# Altium project main.PrjPcb
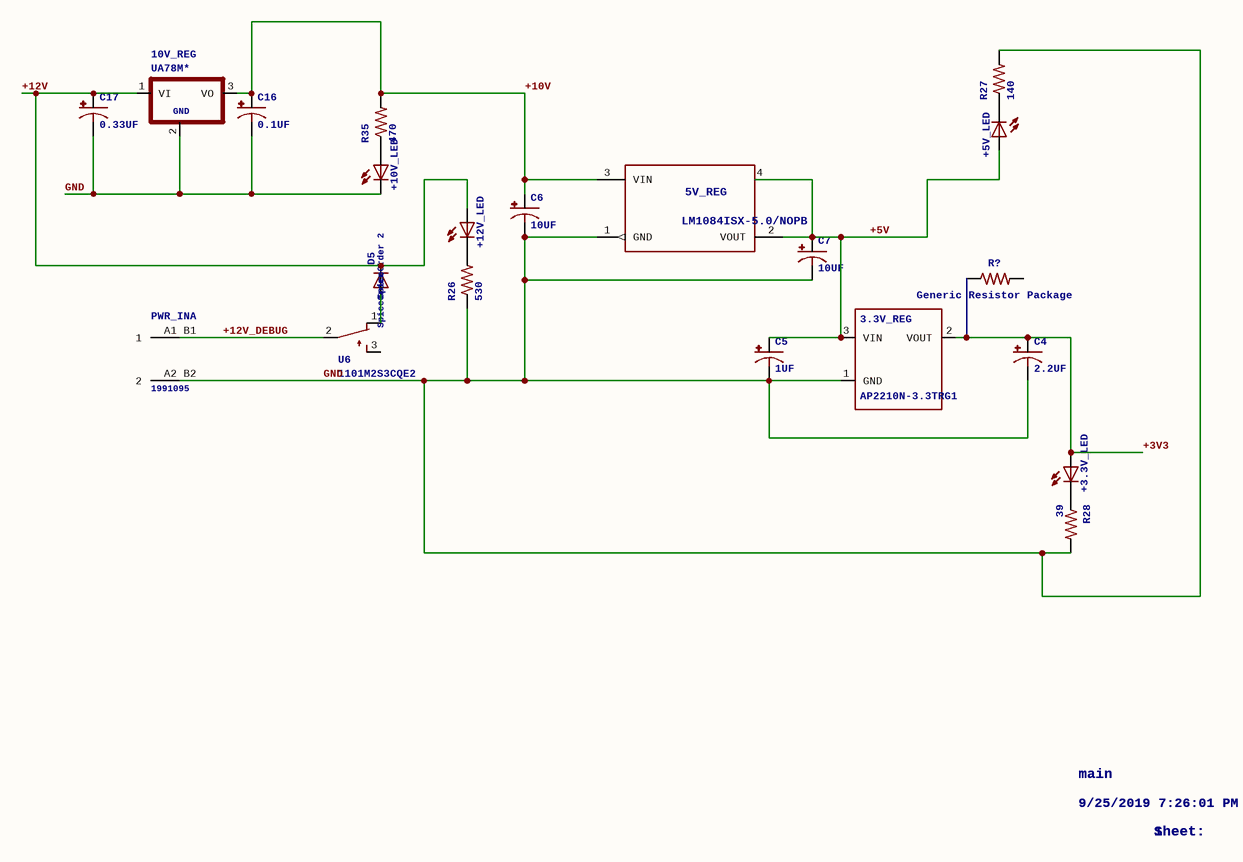
[diagram p0: main_0.SchDoc]
10 sheets, 195 parts. Net scope: global (net labels, ports and power ports of the same name join across sheets).
Board file: main.PcbDoc
Sheets:
  main_0.SchDoc
  main_1.SchDoc
  main_3.SchDoc
  main_2.SchDoc
  main_4.SchDoc
  main_5.SchDoc
  main_6.SchDoc
  main_7.SchDoc
  main_8.SchDoc
  main_9.SchDoc

## Sheet main_0.SchDoc: main
size 282 x 200 mm; Date: 9/25/2019 7:26:01 PM; SheetNumber: 1; CNAME: RJ Cunningham; GateName_1: G$1; SymbolName_1: A4L-LOC; LibraryName: frames; DeviceSetName: A4L-LOC

### Parts
(Parts that share a designator on the sheet are numbered #1, #2 ... from top to bottom, then left to right.)
3.3V_REG  AP2210N-3.3TRG1  [SOT23]
5V_REG  LM1084ISX-5.0/NOPB  [TS3B]
10V_REG  UA78M*  [TO220S]
+3.3V_LED  LED5MM  [LED5MM]  (value not drawn)
+5V_LED  LED5MM  [LED5MM]  (value not drawn)
+10V_LED  LED5MM  [LED5MM]  (value not drawn)
+12V_LED  LED5MM  [LED5MM]  (value not drawn)
C4  2.2UF  [E2,5-5]
C5  1UF  [E2,5-5]
C6  10UF  [E2,5-5]
C7  10UF  [E2,5-5]
C16  0.1UF  [E2,5-5]
C17  0.33UF  [E2,5-5]
D5  SpiceOrder1: SpiceOrder 1  SpiceOrder2: SpiceOrder 2  [DO201-15]  (hidden comment: DIODE-DO201-15)
PWR_IN  1991095  [1991095]  (value not drawn)  (parts A,B of 2)
R26  530  [R0805]
R27  140  [R0805]
R28  39  [R0805]
R35  470  [R0805]
R?#1  Generic Resistor Package  [0402]
U6  1101M2S3CQE2  [1101M2S3CQE2]

### Nets
+3V3: 3.3V_REG.2(VOUT) +3.3V_LED.A C4.+ R?#1.1
+5V: 3.3V_REG.3(VIN) 5V_REG.2(VOUT) 5V_REG.4 +5V_LED.A C5.+ C7.+
+10V: 5V_REG.3(VIN) 10V_REG.3(VO) C6.+ C16.+ R35.2
+12V: 10V_REG.1(VI) +12V_LED.A C17.+ D5.C
+12V_DEBUG: PWR_IN.A1_B1(1) U6.2(P)
GND: 3.3V_REG.1(GND) 5V_REG.1(GND) 10V_REG.2(GND) +10V_LED.K(C) C4.- C5.- C6.- C7.- C16.- C17.- PWR_IN.A2_B2(2) R26.1 R27.2 R28.2
Net+3.3V_LED_K: +3.3V_LED.K(C) R28.1
Net+5V_LED_K: +5V_LED.K(C) R27.1
Net+10V_LED_A: +10V_LED.A R35.1
Net+12V_LED_K: +12V_LED.K(C) R26.2
NetD5_A: D5.A U6.1(O)

Not connected (* = marked no-connect by the designer): R?#1 2; U6 3(S)

### Notes on the sheet
- main
- 9/25/2019 7:26:01 PM
- 1
- Sheet:
- 2
- 3
- 4
- 5
- 6
- A
- B
- C
- D

### Library data of the parts
3.3V_REG = AP2210N-3.3TRG1: 3.3V regulator300mA rating.; GateName_1: G$1; SymbolName_1: AP2210N-3.3TRG1; LibraryName: diodes-extra; DeviceSetName: AP2210N-3.3TRG1
5V_REG = LM1084ISX-5.0/NOPB: MANUFACTURER_PART_NUMBER: LM1084ISX5.0NOPB; GateName_1: A; SymbolName_1: LM1084IS-5.0; VENDOR: Texas Instruments; LibraryName: texas-extra; DeviceSetName: LM1084ISX-5.0/NOPB
10V_REG = UA78M*: POSITIVE-VOLTAGE REGULATORSSource: http://focus.ti.com/lit/ds/symlink/ua78m33.pdf; GateName_1: G$1; SymbolName_1: 78XX2GND; LibraryName: texas-extra; DeviceSetName: UA78M*; GND: GND
+3.3V_LED +5V_LED +10V_LED +12V_LED = LED5MM: LEDOSRAM:- CHIPLEDLG R971, LG N971, LY N971, LG Q971, LY Q971, LO R971, LY R971 LH N974, LH R974LS Q976, LO Q976, LY Q976LO Q996- Hyper CHIPLEDLW Q18SLB Q993, LB Q99A, LB R99A- SideLEDLS A670, LO A670, LY A670, LG A670, LP A670LB A673, LV A673, LT A673, LW A673LH A674LY A675LS A676, LA A676, LO A676, LY A676, LW A676LS A679, LY A679, LG A679-  Hyper Micro SIDELEDÂ®LS Y876, LA Y876, LO Y876, LY Y876LT Y87S- SmartLEDLW L88C, LW L88SLB L89C, LB L89S, LG L890LS L89K, LO L89K, LY L89KLS L896, LA L896, LO L896, LY L896- TOPLEDLS T670, LO T670, LY T670, LG T670, LP T670LSG T670, LSP T670, LSY T670, LOP T670, LYG T670LG T671, LOG T671, LSG T671LB T673, LV T673, LT T673, LW T673LH T674LS T676, LA T676, LO T676, LY T676, LB T676, LH T676, LSB T676, LW T676LB T67C, LV T67C, LT T67C, LS T67K, LO T67K, LY T67K, LW E67CLS E67B, LA E67B, LO E67B, LY E67B, LB E67C, LV E67C, LT E67CLW T67CLS T679, LY T679, LG T679LS T770, LO T770, LY T770, LG T770, LP T770LB T773, LV T773, LT T773, LW T773LH T774LS E675, LA E675, LY E675, LS T675LS T776, LA T776, LO T776, LY T776, LB T776LHGB T686LT T68C, LB T68C- Hyper Mini TOPLEDÂ®LB M676- Mini TOPLED SantanaÂ®LG M470LS M47K, LO M47K, LY M47K Source: http://www.osram.convergy.deLUXEON:- LUMILEDÂ®LXK2-PW12-R00, LXK2-PW12-S00, LXK2-PW14-U00, LXK2-PW14-V00LXK2-PM12-R00, LXK2-PM12-S00, LXK2-PM14-U00LXK2-PE12-Q00, LXK2-PE12-R00, LXK2-PE12-S00, LXK2-PE14-T00, LXK2-PE14-U00LXK2-PB12-K00, LXK2-PB12-L00, LXK2-PB12-M00, LXK2-PB14-N00, LXK2-PB14-P00, LXK2-PB14-Q00LXK2-PR12-L00, LXK2-PR12-M00, LXK2-PR14-Q00, LXK2-PR14-R00LXK2-PD12-Q00, LXK2-PD12-R00, LXK2-PD12-S00LXK2-PH12-R00, LXK2-PH12-S00LXK2-PL12-P00, LXK2-PL12-Q00, LXK2-PL12-R00 Source: www.luxeon.comKINGBRIGHT:KA-3528ASYCSource: www.kingbright.com; GateName_1: G$1; SymbolName_1: LED; DeviceName: 5MM; LibraryName: led; DeviceSetName: LED
C4-C7 C16 C17 = CPOL-USE2.5-5: POLARIZED CAPACITOR, American symbol; GateName_1: G$1; DeviceName: E2.5-5; SymbolName_1: CPOL-US; LibraryName: rcl; DeviceSetName: CPOL-US
D5 = DIODE-DO201-15: DIODE; GateName_1: G$1; SymbolName_1: D; DeviceSetName: DIODE-; DeviceName: DO201-15; LibraryName: diode
PWR_IN = 1991095: GateName_1: CON; SymbolName_1: STP1; GateName_2: G$2; SymbolName_2: STP2; LibraryName: con-phoenix-500-extra; DeviceSetName: 1991095
R26-R28 R35 = R-US_R0805: RESISTOR, American symbol; GateName_1: G$1; SymbolName_1: R-US; DeviceSetName: R-US_; DeviceName: R0805; LibraryName: resistor
R?#1 = RESISTOR0402: GateName_1: G$1; SymbolName_1: RESISTOR; DeviceName: 0402; LibraryName: Big Red Library; DeviceSetName: RESISTOR; Package: 0402
U6 = 1101M2S3CQE2: GateName_1: A; SymbolName_1: ON-MOM; VENDOR: C&K; LibraryName: SLIDE_SW; DeviceSetName: 1101M2S3CQE2; COPYRIGHT: Copyright (C) 2015 Accelerated Designs. All rights reserved; MANUFACTURER_PART_NUMBER: 1101M2S3CQE2

## Sheet main_1.SchDoc: main
size 282 x 200 mm; Date: 9/25/2019 7:26:04 PM; SheetNumber: 2; CNAME: RJ Cunningham; GateName_1: G$1; SymbolName_1: A4L-LOC; LibraryName: frames; DeviceSetName: A4L-LOC
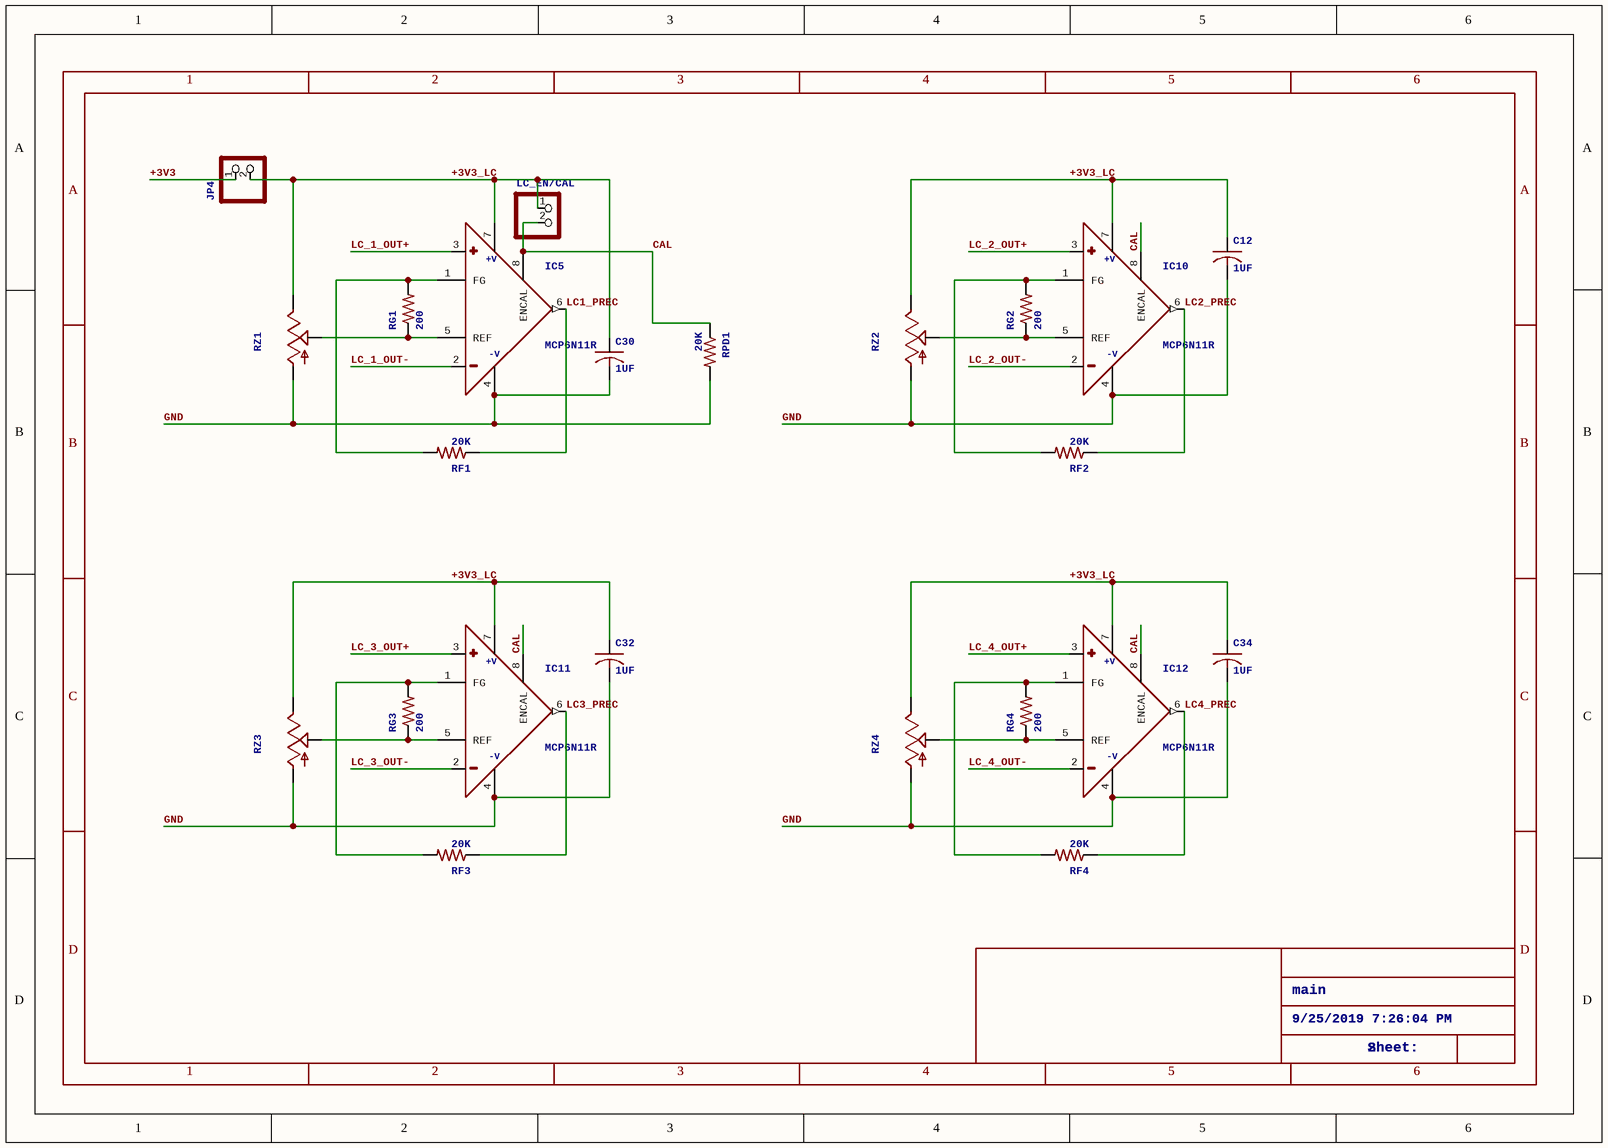
[diagram p1: main_1.SchDoc]

### Parts
C12  1UF  [C0805]
C30  1UF  [C0805]
C32  1UF  [C0805]
C34  1UF  [C0805]
IC5  MCP6N11R  [SO-8]
IC10  MCP6N11R  [SO-8]
IC11  MCP6N11R  [SO-8]
IC12  MCP6N11R  [SO-8]
JP4  PINHD-1X2  [1X02]  (value not drawn)
LC_EN/CAL  PINHD-1X2  [1X02]  (value not drawn)
RF1  20K  [R0805]
RF2  20K  [R0805]
RF3  20K  [R0805]
RF4  20K  [R0805]
RG1  200  [R0805]
RG2  200  [R0805]
RG3  200  [R0805]
RG4  200  [R0805]
RPD1  20K  [R0805]
RZ1  TRIM_US-S64W  [S64W]  (value not drawn)
RZ2  TRIM_US-S64W  [S64W]  (value not drawn)
RZ3  TRIM_US-S64W  [S64W]  (value not drawn)
RZ4  TRIM_US-S64W  [S64W]  (value not drawn)

### Nets
+3V3: JP4.1
+3V3_LC: C12.1 C30.1 C32.1 C34.1 IC5.7(+V) IC10.7(+V) IC11.7(+V) IC12.7(+V) JP4.2 LC_EN/CAL.1 RZ1.E RZ2.E RZ3.E RZ4.E
CAL: IC5.8(ENCAL) IC10.8(ENCAL) IC11.8(ENCAL) IC12.8(ENCAL) LC_EN/CAL.2 RPD1.1
GND: C12.2 C30.2 C32.2 C34.2 IC5.4(-V) IC10.4(-V) IC11.4(-V) IC12.4(-V) RPD1.2 RZ1.A RZ2.A RZ3.A RZ4.A
LC1_PREC: IC5.6(OUT) RF1.1
LC2_PREC: IC10.6(OUT) RF2.1
LC3_PREC: IC11.6(OUT) RF3.1
LC4_PREC: IC12.6(OUT) RF4.1
LC_1_OUT+: IC5.3(+)
LC_1_OUT-: IC5.2(-)
LC_2_OUT+: IC10.3(+)
LC_2_OUT-: IC10.2(-)
LC_3_OUT+: IC11.3(+)
LC_3_OUT-: IC11.2(-)
LC_4_OUT+: IC12.3(+)
LC_4_OUT-: IC12.2(-)
NetIC5_1: IC5.1(FG) RF1.2 RG1.2
NetIC5_5: IC5.5(REF) RG1.1 RZ1.S
NetIC10_1: IC10.1(FG) RF2.2 RG2.2
NetIC10_5: IC10.5(REF) RG2.1 RZ2.S
NetIC11_1: IC11.1(FG) RF3.2 RG3.2
NetIC11_5: IC11.5(REF) RG3.1 RZ3.S
NetIC12_1: IC12.1(FG) RF4.2 RG4.2
NetIC12_5: IC12.5(REF) RG4.1 RZ4.S

### Notes on the sheet
- main
- 9/25/2019 7:26:04 PM
- 2
- Sheet:
- 1
- 3
- 4
- 5
- 6
- A
- B
- C
- D

### Library data of the parts
C12 C30 C32 C34 = C-USC0805: CAPACITOR, American symbol; GateName_1: G$1; SymbolName_1: C-US; DeviceName: C0805; LibraryName: rcl; DeviceSetName: C-US; SPICEPREFIX: C
IC5 IC10-IC12 = MCP6N11R: Low Cost, Low Power, Instrumentation AmplifierSource: http://www.analog.com/UploadedFiles/Data_Sheets/37793330023930AD620_e.pdf; MPN: AD620AR; GateName_1: G$1; DeviceName: R; SymbolName_1: MCP6N11; LibraryName: microchip-extra; DeviceSetName: MCP6N11; MF: *; OC_FARNELL: 1464424; OC_NEWARK: 05F7109; +V: +V; -V: -V
JP4 LC_EN/CAL = PINHD-1X2: PIN HEADER; GateName_1: G$1; SymbolName_1: PINHD2; LibraryName: pinhead; DeviceSetName: PINHD-1X2
RF1-RF4 RG1-RG4 RPD1 = R-US_R0805: as R26 on sheet main_0; DeviceName: R0805; LibraryName: rcl
RZ1-RZ4 = TRIM_US-S64W: POTENTIOMETER; GateName_1: G$1; SymbolName_1: POT_US-; DeviceName: S64W; LibraryName: pot; DeviceSetName: TRIM_US-

## Sheet main_3.SchDoc: main
size 282 x 200 mm; Date: 9/25/2019 7:26:09 PM; SheetNumber: 4; CNAME: RJ Cunningham; GateName_1: G$1; SymbolName_1: A4L-LOC; LibraryName: frames; DeviceSetName: A4L-LOC
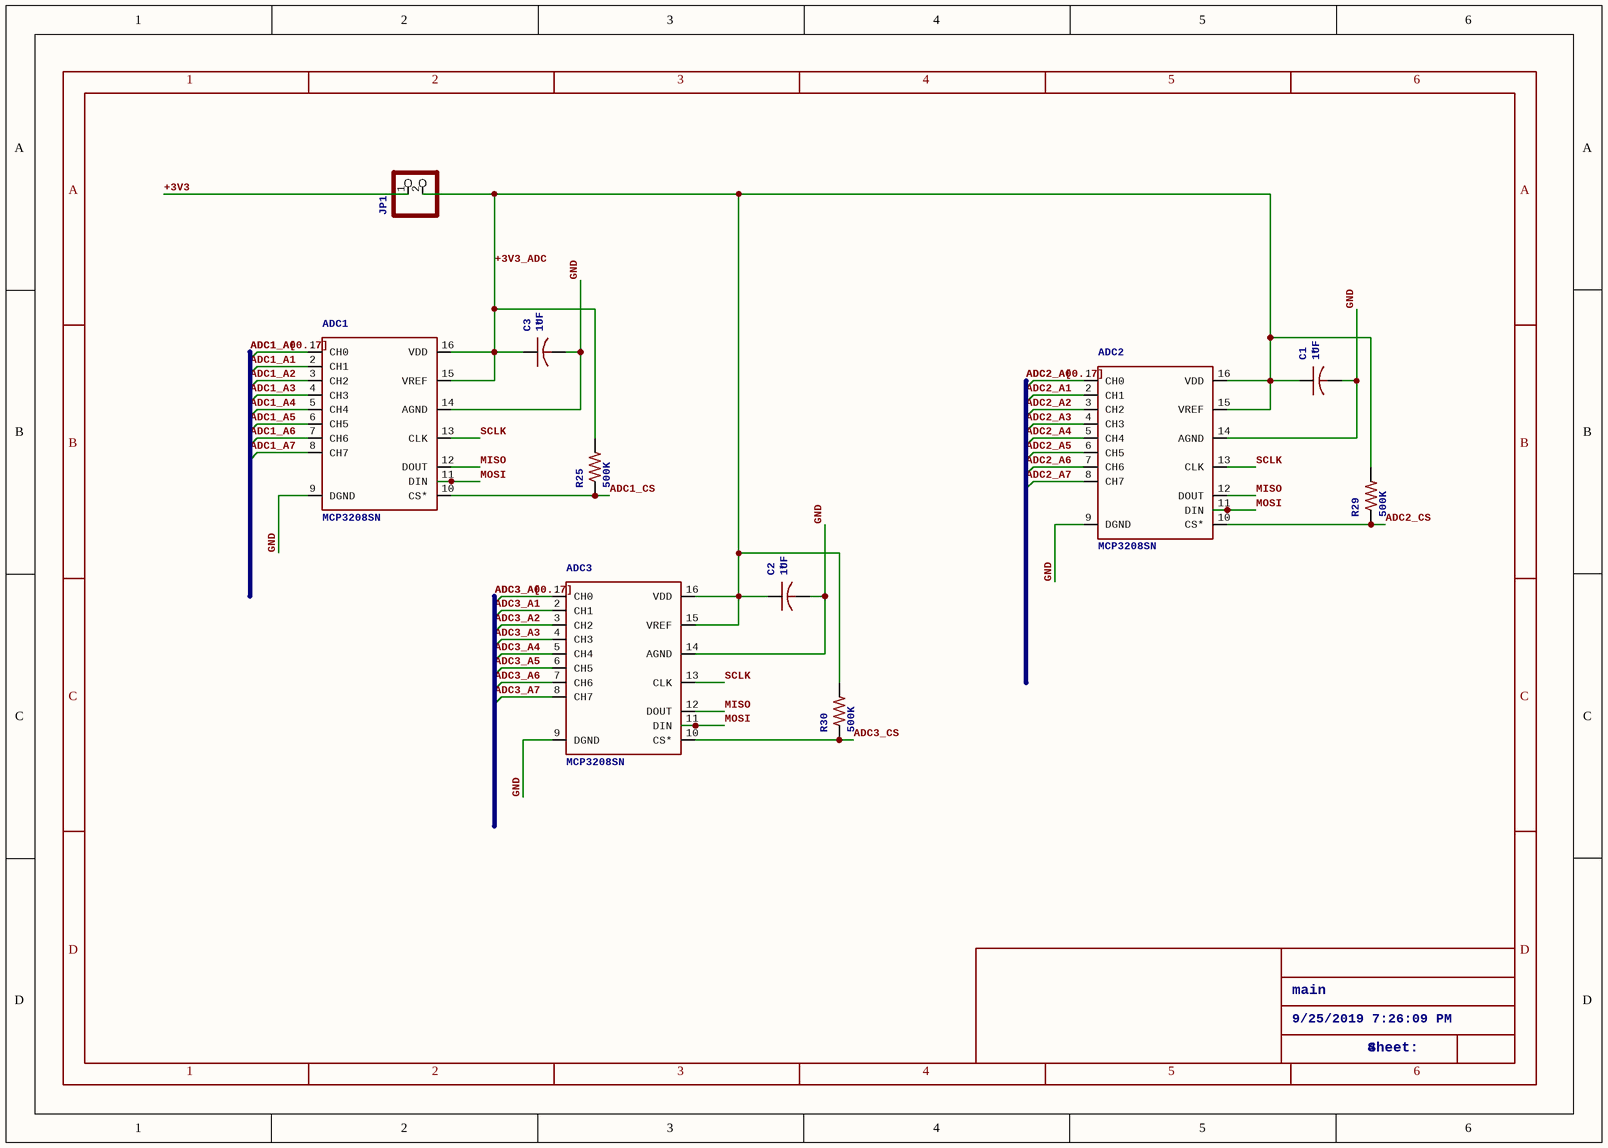
[diagram p2: main_3.SchDoc]

### Parts
ADC1  MCP3208SN  [SO-16]
ADC2  MCP3208SN  [SO-16]
ADC3  MCP3208SN  [SO-16]
C1  1UF  [C0805]
C2  1UF  [C0805]
C3  1UF  [C0805]
JP1  PINHD-1X2  [1X02]  (value not drawn)
R25  500K  [R0805]
R29  500K  [R0805]
R30  500K  [R0805]

### Nets
+3V3: JP1.1
+3V3_ADC: ADC1.15(VREF) ADC1.16(VDD) ADC2.15(VREF) ADC2.16(VDD) ADC3.15(VREF) ADC3.16(VDD) C1.1 C2.1 C3.1 JP1.2 R25.2 R29.2 R30.2
ADC1_CS: ADC1.10(CS*) R25.1
ADC2_CS: ADC2.10(CS*) R29.1
ADC3_CS: ADC3.10(CS*) R30.1
GND: ADC1.9(DGND) ADC1.14(AGND) ADC2.9(DGND) ADC2.14(AGND) ADC3.9(DGND) ADC3.14(AGND) C1.2 C2.2 C3.2
MISO: ADC1.12(DOUT) ADC2.12(DOUT) ADC3.12(DOUT)
MOSI: ADC1.11(DIN) ADC2.11(DIN) ADC3.11(DIN)
SCLK: ADC1.13(CLK) ADC2.13(CLK) ADC3.13(CLK)

Not connected (* = marked no-connect by the designer): ADC1 1(CH0) 2(CH1) 3(CH2) 4(CH3) 5(CH4) 6(CH5) 7(CH6) 8(CH7); ADC2 1(CH0) 2(CH1) 3(CH2) 4(CH3) 5(CH4) 6(CH5) 7(CH6) 8(CH7); ADC3 1(CH0) 2(CH1) 3(CH2) 4(CH3) 5(CH4) 6(CH5) 7(CH6) 8(CH7)

### Buses and harness runs
bus ADC1_A0 = ADC1_A1 = ADC1_A2 = ADC1_A3 = ADC1_A4 = ADC1_A5 = ADC1_A6 = ADC1_A7 = ADC1_A[0..7]
bus ADC2_A0 = ADC2_A1 = ADC2_A2 = ADC2_A3 = ADC2_A4 = ADC2_A5 = ADC2_A6 = ADC2_A7 = ADC2_A[0..7]
bus ADC3_A0 = ADC3_A1 = ADC3_A2 = ADC3_A3 = ADC3_A4 = ADC3_A5 = ADC3_A6 = ADC3_A7 = ADC3_A[0..7]

### Notes on the sheet
- main
- 9/25/2019 7:26:09 PM
- 4
- Sheet:
- 1
- 2
- 3
- 5
- 6
- A
- B
- C
- D

### Library data of the parts
ADC1-ADC3 = MCP3208SN: 2.7V Dual Channel 12-Bit A/D Converter with SPI Serial InterfaceSource: http://ww1.microchip.com/downloads/en/DeviceDoc/21034D.pdf; MPN: MCP3202-CI/SN; GateName_1: P; DeviceName: SN; SymbolName_1: MCP3208; LibraryName: microchip-extra; DeviceSetName: MCP3208; MF: MICROCHIP; OC_FARNELL: 1196803; OC_NEWARK: 19C7207
C1-C3 = C-USC0805: as C12 on sheet main_1; DeviceName: C0805; LibraryName: rcl; DeviceSetName: C-US; NAME: *; SPICEPREFIX: C
JP1 = PINHD-1X2: as JP4 on sheet main_1; LibraryName: pinhead; DeviceSetName: PINHD-1X2
R25 R29 R30 = R-US_R0805: as R26 on sheet main_0; DeviceName: R0805; LibraryName: rcl

## Sheet main_2.SchDoc: main
size 282 x 200 mm; Date: 9/25/2019 7:26:07 PM; SheetNumber: 3; CNAME: RJ Cunningham; GateName_1: G$1; SymbolName_1: A4L-LOC; LibraryName: frames; DeviceSetName: A4L-LOC
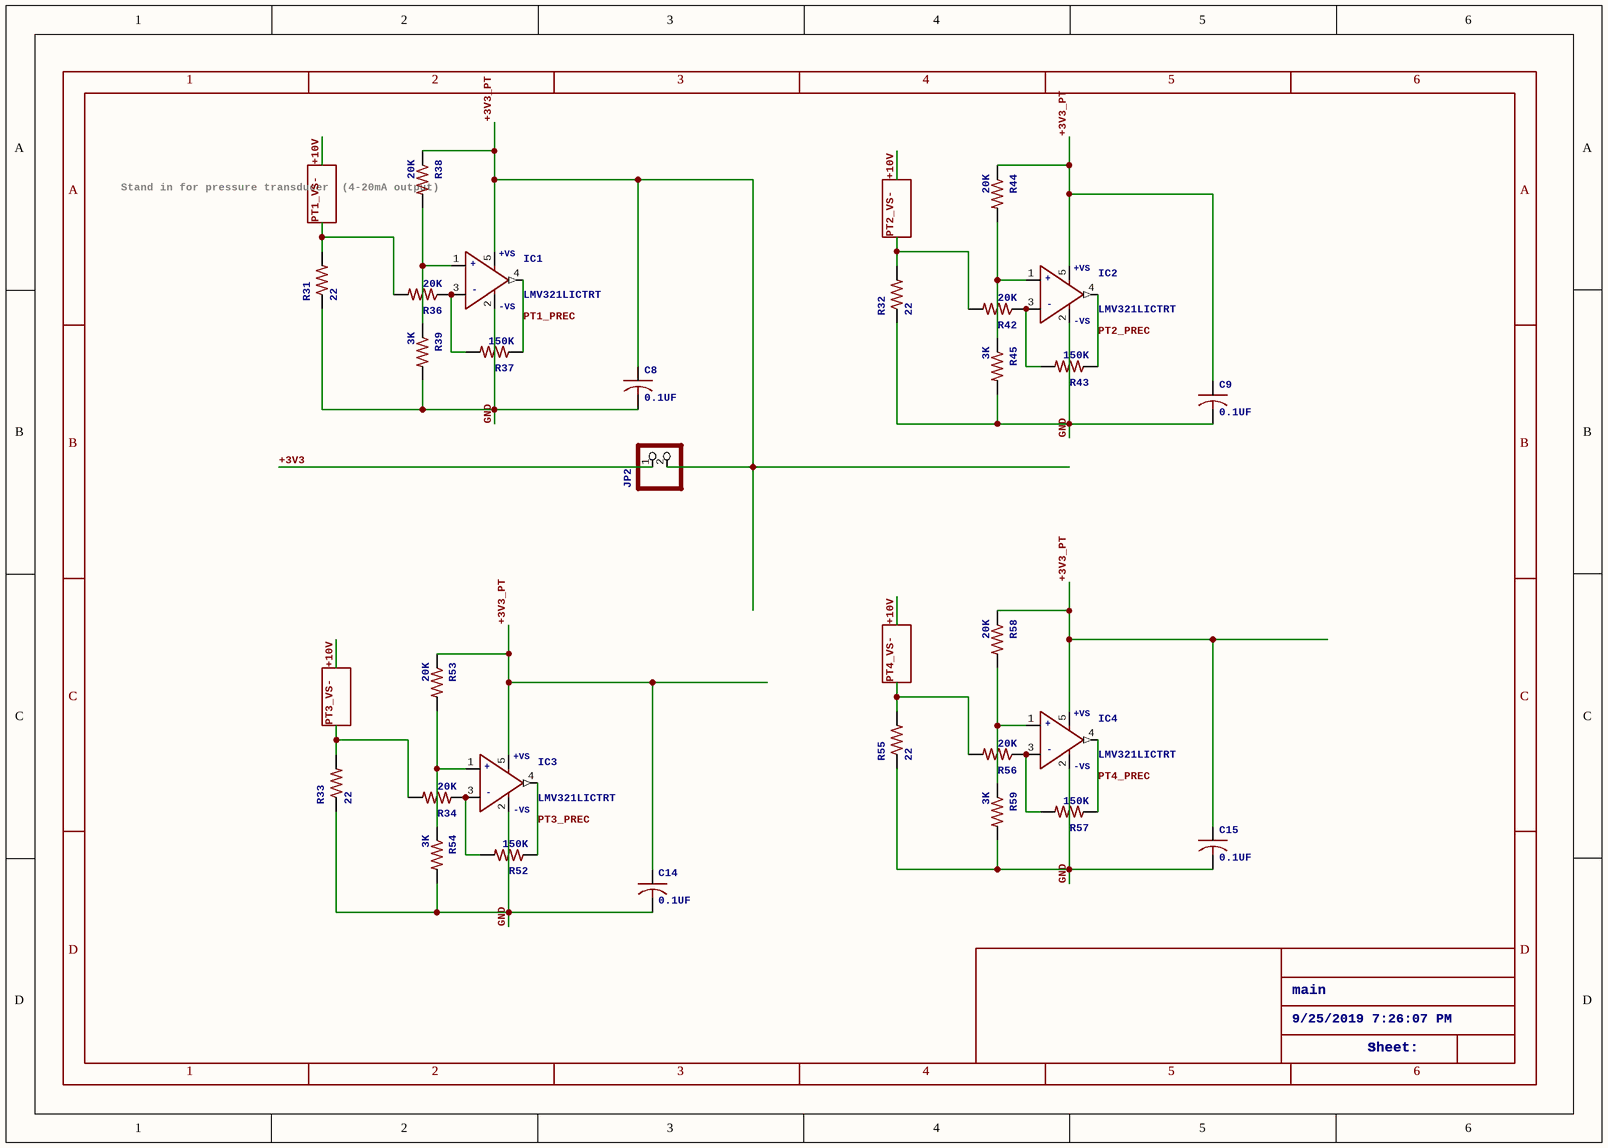
[diagram p3: main_2.SchDoc]

### Parts
C8  0.1UF  [C0805]
C9  0.1UF  [C0805]
C14  0.1UF  [C0805]
C15  0.1UF  [C0805]
IC1  LMV321LICTRT  [SOT23-5]
IC2  LMV321LICTRT  [SOT23-5]
IC3  LMV321LICTRT  [SOT23-5]
IC4  LMV321LICTRT  [SOT23-5]
JP2  PINHD-1X2  [1X02]  (value not drawn)
R31  22  [R0805]
R32  22  [R0805]
R33  22  [R0805]
R34  20K  [R0805]
R36  20K  [R0805]
R37  150K  [R0805]
R38  20K  [R0805]
R39  3K  [R0805]
R42  20K  [R0805]
R43  150K  [R0805]
R44  20K  [R0805]
R45  3K  [R0805]
R52  150K  [R0805]
R53  20K  [R0805]
R54  3K  [R0805]
R55  22  [R0805]
R56  20K  [R0805]
R57  150K  [R0805]
R58  20K  [R0805]
R59  3K  [R0805]

### Nets
+3V3: JP2.1
+3V3_PT: C8.1 C9.1 C14.1 C15.1 IC1.5(+VS) IC2.5(+VS) IC3.5(+VS) IC4.5(+VS) JP2.2 R38.1 R44.1 R53.1 R58.1
GND: C8.2 C9.2 C14.2 C15.2 IC1.2(-VS) IC2.2(-VS) IC3.2(-VS) IC4.2(-VS) R31.1 R32.1 R33.1 R39.2 R45.2 R54.2 R55.1 R59.2
PT1_PREC: IC1.4(OUT) R37.1
PT1_VS-: R31.2 R36.2
PT2_PREC: IC2.4(OUT) R43.1
PT2_VS-: R32.2 R42.2
PT3_PREC: IC3.4(OUT) R52.1
PT3_VS-: R33.2 R34.2
PT4_PREC: IC4.4(OUT) R57.1
PT4_VS-: R55.2 R56.2
NetIC1_1: IC1.1(IN+) R38.2 R39.1
NetIC1_3: IC1.3(IN-) R36.1 R37.2
NetIC2_1: IC2.1(IN+) R44.2 R45.1
NetIC2_3: IC2.3(IN-) R42.1 R43.2
NetIC3_1: IC3.1(IN+) R53.2 R54.1
NetIC3_3: IC3.3(IN-) R34.1 R52.2
NetIC4_1: IC4.1(IN+) R58.2 R59.1
NetIC4_3: IC4.3(IN-) R56.1 R57.2

### Notes on the sheet
- (near R38) Stand in for pressure transducer
  (4-20mA output)
- main
- 9/25/2019 7:26:07 PM
- 3
- Sheet:
- 1
- 2
- 4
- 5
- 6
- A
- B
- C
- D

### Library data of the parts
C8 C9 C14 C15 = C-USC0805: as C12 on sheet main_1; DeviceName: C0805; LibraryName: rcl; DeviceSetName: C-US; SPICEPREFIX: C
IC1-IC4 = LMV321LICTRT: High Performance, 145 MHz FastFET Op AmpsSource: http://www.analog.com/static/imported-files/data_sheets/AD8065_8066.pdf; MPN: AD8065ARTZ-REEL7; GateName_1: G$; SymbolName_1: OP+-VS; DeviceName: RT; MF: ALTERA CORPORATION; LibraryName: st-microelectronics-extra; DeviceSetName: LMV321LICT; OC_FARNELL: 1464845; OC_NEWARK: 59K6316; +: +; -: -; +VS: +VS; -VS: -VS
JP2 = PINHD-1X2: as JP4 on sheet main_1; LibraryName: pinhead; DeviceSetName: PINHD-1X2
R31-R34 R36-R39 R42-R45 R52-R59 = R-US_R0805: as R26 on sheet main_0; DeviceName: R0805; LibraryName: rcl

## Sheet main_4.SchDoc: main
size 282 x 200 mm; Date: 9/25/2019 7:26:12 PM; SheetNumber: 5; CNAME: RJ Cunningham; GateName_1: G$1; SymbolName_1: A4L-LOC; LibraryName: frames; DeviceSetName: A4L-LOC
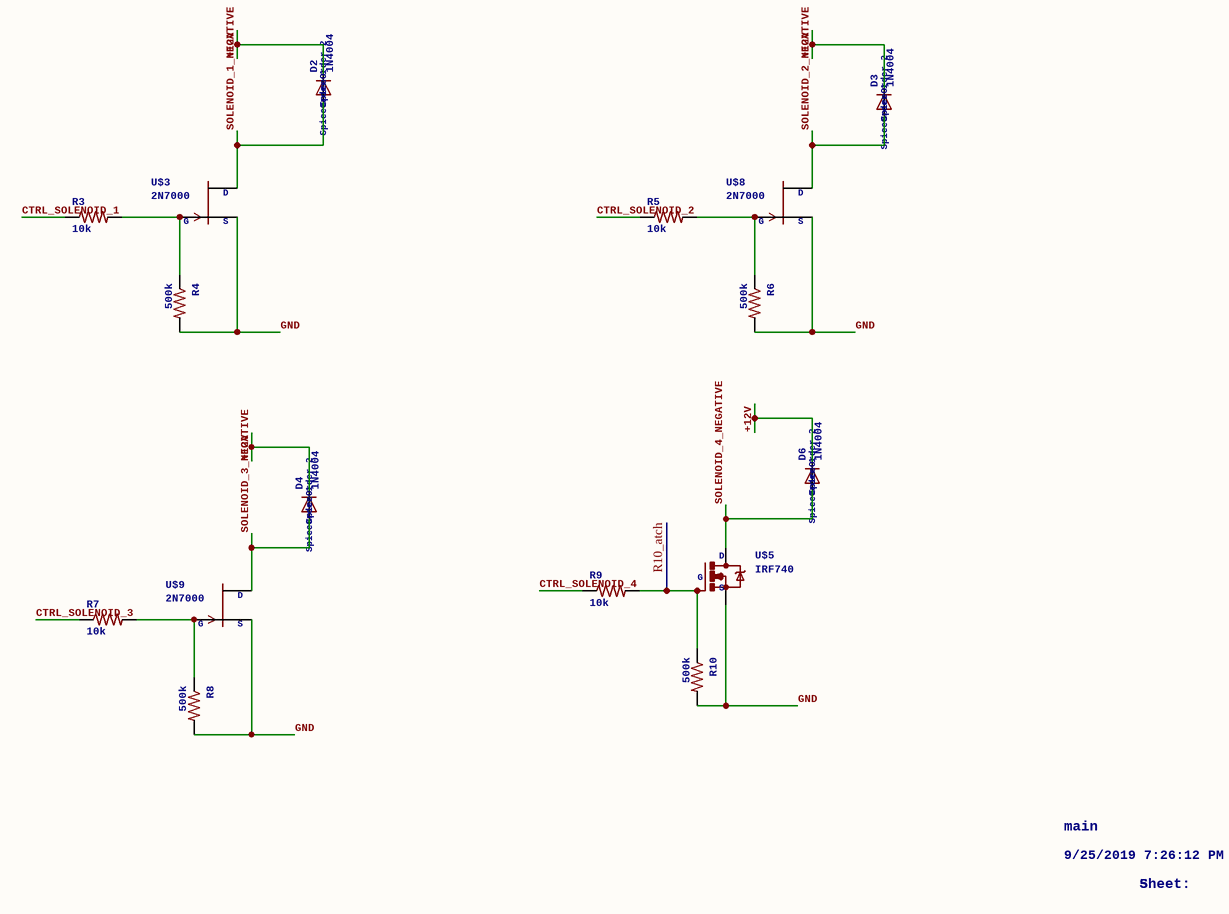
[diagram p4: main_4.SchDoc]

### Parts
D2  1N4004  SpiceOrder1: SpiceOrder 1  SpiceOrder2: SpiceOrder 2  [DO41-10]
D3  1N4004  SpiceOrder1: SpiceOrder 1  SpiceOrder2: SpiceOrder 2  [DO41-10]
D4  1N4004  SpiceOrder1: SpiceOrder 1  SpiceOrder2: SpiceOrder 2  [DO41-10]
D6  1N4004  SpiceOrder1: SpiceOrder 1  SpiceOrder2: SpiceOrder 2  [DO41-10]
R3  10k  [R0805]
R4  500k  [R0805]
R5  10k  [R0805]
R6  500k  [R0805]
R7  10k  [R0805]
R8  500k  [R0805]
R9  10k  [R0805]
R10  500k  [R0805]
U$3  2N7000  [SOT23]
U$5  IRF740  [TO220BV]
U$8  2N7000  [SOT23]
U$9  2N7000  [SOT23]

### Nets
+12V: D2.C D3.C D4.C D6.C
CTRL_SOLENOID_1: R3.1
CTRL_SOLENOID_2: R5.1
CTRL_SOLENOID_3: R7.1
CTRL_SOLENOID_4: R9.1
GND: R4.2 R6.2 R8.2 R10.2 U$3.2(S) U$5.S U$8.2(S) U$9.2(S)
R10_atch: R9.2 R10.1 U$5.G
SOLENOID_1_NEGATIVE: D2.A U$3.3(D)
SOLENOID_2_NEGATIVE: D3.A U$8.3(D)
SOLENOID_3_NEGATIVE: D4.A U$9.3(D)
SOLENOID_4_NEGATIVE: D6.A U$5.D
NetR3_2: R3.2 R4.1 U$3.1(G)
NetR5_2: R5.2 R6.1 U$8.1(G)
NetR7_2: R7.2 R8.1 U$9.1(G)

### Notes on the sheet
- main
- 9/25/2019 7:26:12 PM
- 5
- Sheet:
- 1
- 2
- 3
- 4
- 6
- A
- B
- C
- D

### Library data of the parts
D2-D4 D6 = 1N4004: DIODEgeneral purpose rectifier, 1 A; GateName_1: 1; SymbolName_1: D; LibraryName: diode; DeviceSetName: 1N4004
R3-R10 = R-US_R0805: as R26 on sheet main_0; DeviceName: R0805; LibraryName: rcl
U$3 U$8 U$9 = 2N7000: GateName_1: G$1; SymbolName_1: JFET-N; LibraryName: transistor-fet-extra; DeviceSetName: 2N7000; D: D; S: S; G: G
U$5 = IRF740: N-CHANNEL MOS FET; GateName_1: G$1; SymbolName_1: MFNS; LibraryName: transistor-power; DeviceSetName: IRF740; D: D; S: S; G: G

## Sheet main_5.SchDoc: main
size 282 x 200 mm; Date: 9/25/2019 7:26:14 PM; SheetNumber: 6; CNAME: RJ Cunningham; GateName_1: G$1; SymbolName_1: A4L-LOC; LibraryName: frames; DeviceSetName: A4L-LOC
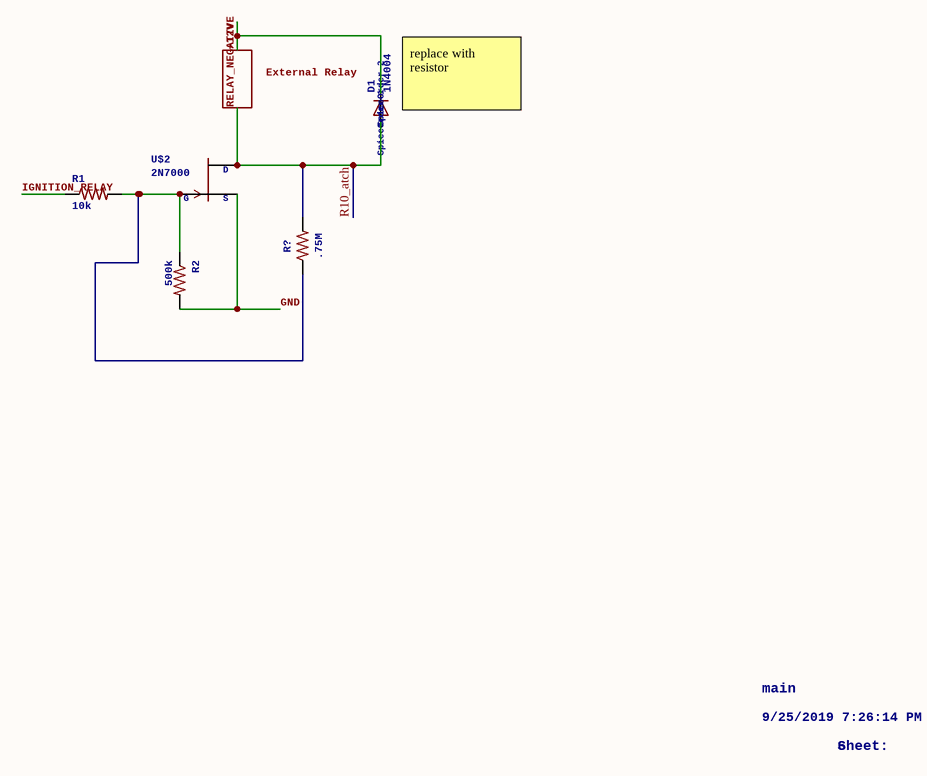
[diagram p5: main_5.SchDoc]

### Parts
(Parts that share a designator on the sheet are numbered #1, #2 ... from top to bottom, then left to right.)
D1  1N4004  SpiceOrder1: SpiceOrder 1  SpiceOrder2: SpiceOrder 2  [DO41-10]
R1  10k  [R0805]
R2  500k  [R0805]
R?#2  .75M  [0402]
U$2  2N7000  [SOT23]

### Nets
+12V: D1.C
GND: R2.2 U$2.2(S)
IGNITION_RELAY: R1.1
R10_atch: D1.A R?#2.2 U$2.3(D)  [also labelled RELAY_NEGATIVE]
NetR1_2: R1.2 R2.1 R?#2.1 U$2.1(G)

### Notes on the sheet
- (near D1) External Relay
- (near D1) replace with resistor
- main
- 9/25/2019 7:26:14 PM
- 6
- Sheet:
- 1
- 2
- 3
- 4
- 5
- A
- B
- C
- D

### Library data of the parts
D1 = 1N4004: as D2 on sheet main_4; LibraryName: diode; DeviceSetName: 1N4004
R1 R2 = R-US_R0805: as R26 on sheet main_0; DeviceName: R0805; LibraryName: rcl
R?#2 = RESISTOR0402: value gotten from measurement after luna damage; GateName_1: G$1; SymbolName_1: RESISTOR; DeviceName: 0402; LibraryName: Big Red Library; DeviceSetName: RESISTOR; Package: 0402
U$2 = 2N7000: GateName_1: G$1; SymbolName_1: JFET-N; LibraryName: transistor-fet-extra; DeviceSetName: 2N7000; D: D; S: S; G: G

## Sheet main_6.SchDoc: main
size 282 x 200 mm; Date: 9/25/2019 7:26:17 PM; SheetNumber: 7; CNAME: RJ Cunningham; GateName_1: G$1; SymbolName_1: A4L-LOC; LibraryName: frames; DeviceSetName: A4L-LOC
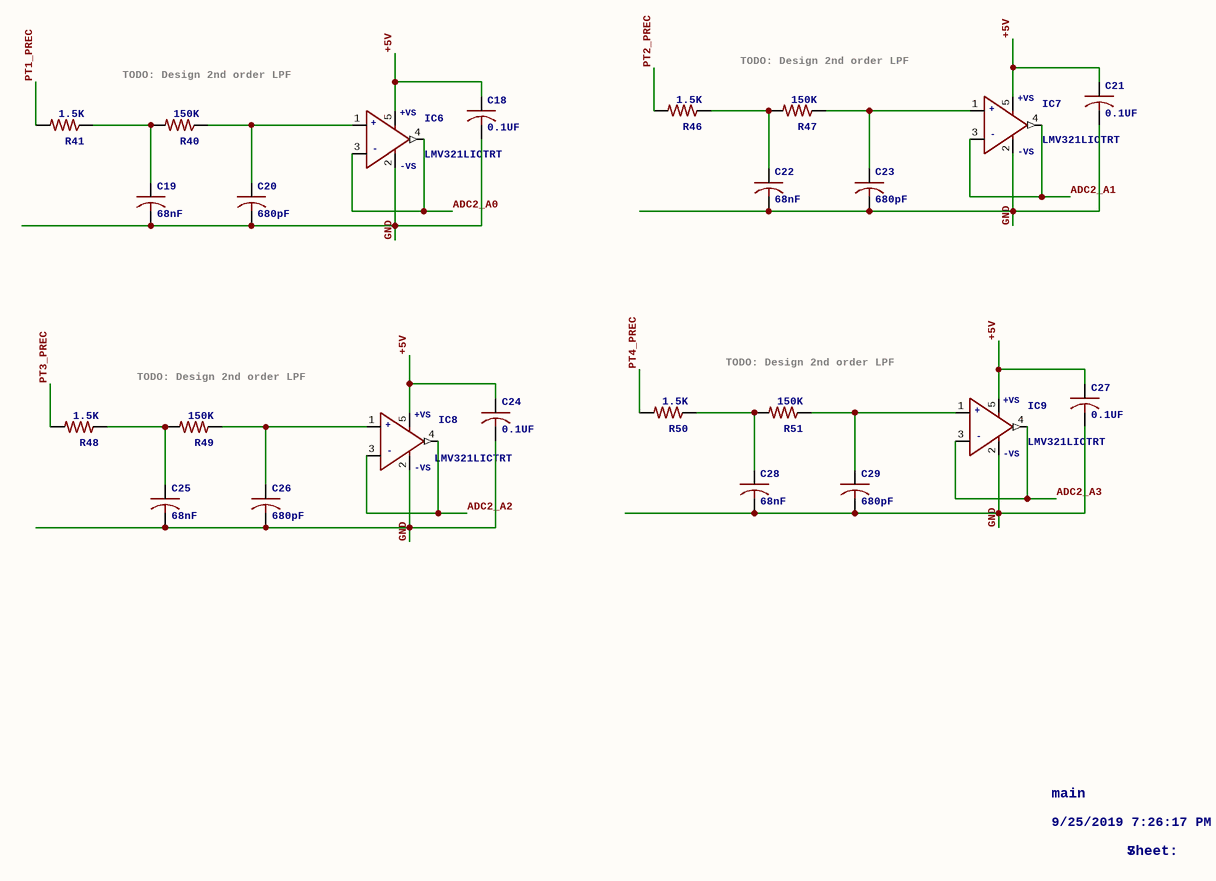
[diagram p6: main_6.SchDoc]

### Parts
C18  0.1UF  [C0805]
C19  68nF  [C0805]
C20  680pF  [C0805]
C21  0.1UF  [C0805]
C22  68nF  [C0805]
C23  680pF  [C0805]
C24  0.1UF  [C0805]
C25  68nF  [C0805]
C26  680pF  [C0805]
C27  0.1UF  [C0805]
C28  68nF  [C0805]
C29  680pF  [C0805]
IC6  LMV321LICTRT  [SOT23-5]
IC7  LMV321LICTRT  [SOT23-5]
IC8  LMV321LICTRT  [SOT23-5]
IC9  LMV321LICTRT  [SOT23-5]
R40  150K  [R0805]
R41  1.5K  [R0805]
R46  1.5K  [R0805]
R47  150K  [R0805]
R48  1.5K  [R0805]
R49  150K  [R0805]
R50  1.5K  [R0805]
R51  150K  [R0805]

### Nets
+5V: C18.1 C21.1 C24.1 C27.1 IC6.5(+VS) IC7.5(+VS) IC8.5(+VS) IC9.5(+VS)
ADC2_A0: IC6.3(IN-) IC6.4(OUT)
ADC2_A1: IC7.3(IN-) IC7.4(OUT)
ADC2_A2: IC8.3(IN-) IC8.4(OUT)
ADC2_A3: IC9.3(IN-) IC9.4(OUT)
GND: C18.2 C19.2 C20.2 C21.2 C22.2 C23.2 C24.2 C25.2 C26.2 C27.2 C28.2 C29.2 IC6.2(-VS) IC7.2(-VS) IC8.2(-VS) IC9.2(-VS)
PT1_PREC: R41.2
PT2_PREC: R46.2
PT3_PREC: R48.2
PT4_PREC: R50.2
NetC19_1: C19.1 R40.2 R41.1
NetC20_1: C20.1 IC6.1(IN+) R40.1
NetC22_1: C22.1 R46.1 R47.2
NetC23_1: C23.1 IC7.1(IN+) R47.1
NetC25_1: C25.1 R48.1 R49.2
NetC26_1: C26.1 IC8.1(IN+) R49.1
NetC28_1: C28.1 R50.1 R51.2
NetC29_1: C29.1 IC9.1(IN+) R51.1

### Notes on the sheet
- TODO: Design 2nd order LPF
- main
- 9/25/2019 7:26:17 PM
- 7
- Sheet:
- 1
- 2
- 3
- 4
- 5
- 6
- A
- B
- C
- D

### Library data of the parts
C18-C29 = C-USC0805: as C12 on sheet main_1; DeviceName: C0805; LibraryName: rcl; DeviceSetName: C-US; SPICEPREFIX: C
IC6-IC9 = LMV321LICTRT: as IC1 on sheet main_2; LibraryName: st-microelectronics-extra; DeviceSetName: LMV321LICT; OC_FARNELL: 1464845; OC_NEWARK: 59K6316; +: +; -: -; +VS: +VS; -VS: -VS
R40 R41 R46-R51 = R-US_R0805: as R26 on sheet main_0; DeviceName: R0805; LibraryName: rcl

## Sheet main_7.SchDoc: main
size 282 x 200 mm; Date: 9/25/2019 7:26:20 PM; SheetNumber: 8; CNAME: RJ Cunningham; GateName_1: G$1; SymbolName_1: A4L-LOC; LibraryName: frames; DeviceSetName: A4L-LOC
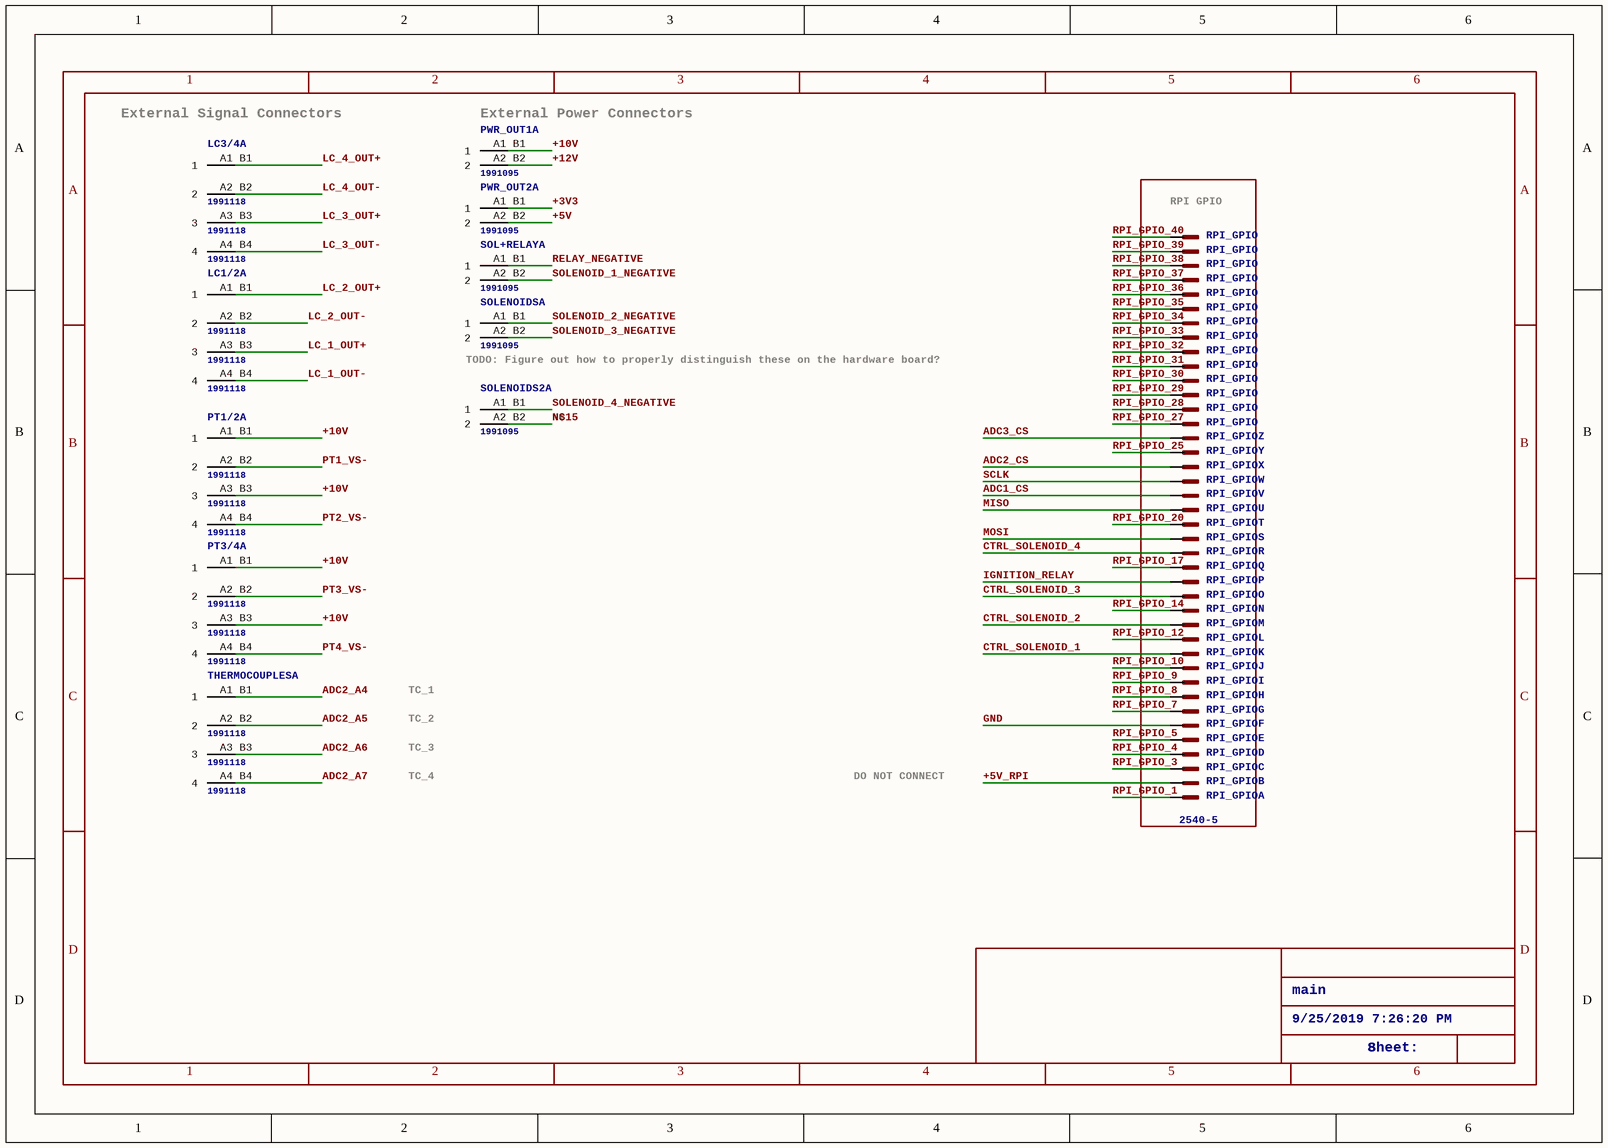
[diagram p7: main_7.SchDoc]

### Parts
LC1/2  1991118  [1991118]  (value not drawn)  (parts A,B,C,D of 4)
LC3/4  1991118  [1991118]  (value not drawn)  (parts A,B,C,D of 4)
PT1/2  1991118  [1991118]  (value not drawn)  (parts A,B,C,D of 4)
PT3/4  1991118  [1991118]  (value not drawn)  (parts A,B,C,D of 4)
PWR_OUT1  1991095  [1991095]  (value not drawn)  (parts A,B of 2)
PWR_OUT2  1991095  [1991095]  (value not drawn)  (parts A,B of 2)
RPI_GPIO  2540-5  [PAK100/2500-5-40]  (parts A,B,C,D,E,F,G,H,I,J,K,L,M,N,O,P,Q,R,S,T,U,V,W,X,Y,Z,27,28,29,30,31,32,33,34,35,36,37,38,39,40 of 40)
SOL+RELAY  1991095  [1991095]  (value not drawn)  (parts A,B of 2)
SOLENOIDS  1991095  [1991095]  (value not drawn)  (parts A,B of 2)
SOLENOIDS2  1991095  [1991095]  (value not drawn)  (parts A,B of 2)
THERMOCOUPLES  1991118  [1991118]  (value not drawn)  (parts A,B,C,D of 4)

### Blocks framed on the sheet
RPI GPIO: RPI_GPIO

### Nets
+3V3: PWR_OUT2.A1_B1(1)
+5V: PWR_OUT2.A2_B2(2)
+5V_RPI: RPI_GPIO.2(KL)
+10V: PT1/2.A1_B1(1) PT1/2.A3_B3(3) PT3/4.A1_B1(1) PT3/4.A3_B3(3) PWR_OUT1.A1_B1(1)
+12V: PWR_OUT1.A2_B2(2)
ADC1_CS: RPI_GPIO.22(KL)
ADC2_A4: THERMOCOUPLES.A1_B1(1)
ADC2_A5: THERMOCOUPLES.A2_B2(2)
ADC2_A6: THERMOCOUPLES.A3_B3(3)
ADC2_A7: THERMOCOUPLES.A4_B4(4)
ADC2_CS: RPI_GPIO.24(KL)
ADC3_CS: RPI_GPIO.26(KL)
CTRL_SOLENOID_1: RPI_GPIO.11(KL)
CTRL_SOLENOID_2: RPI_GPIO.13(KL)
CTRL_SOLENOID_3: RPI_GPIO.15(KL)
CTRL_SOLENOID_4: RPI_GPIO.18(KL)
GND: RPI_GPIO.6(KL)
IGNITION_RELAY: RPI_GPIO.16(KL)
LC_1_OUT+: LC1/2.A3_B3(3)
LC_1_OUT-: LC1/2.A4_B4(4)
LC_2_OUT+: LC1/2.A1_B1(1)
LC_2_OUT-: LC1/2.A2_B2(2)
LC_3_OUT+: LC3/4.A3_B3(3)
LC_3_OUT-: LC3/4.A4_B4(4)
LC_4_OUT+: LC3/4.A1_B1(1)
LC_4_OUT-: LC3/4.A2_B2(2)
MISO: RPI_GPIO.21(KL)
MOSI: RPI_GPIO.19(KL)
N$15: SOLENOIDS2.A2_B2(2)
PT1_VS-: PT1/2.A2_B2(2)
PT2_VS-: PT1/2.A4_B4(4)
PT3_VS-: PT3/4.A2_B2(2)
PT4_VS-: PT3/4.A4_B4(4)
RELAY_NEGATIVE: SOL+RELAY.A1_B1(1)  [project net R10_atch]
RPI_GPIO_1: RPI_GPIO.1(KL)
RPI_GPIO_3: RPI_GPIO.3(KL)
RPI_GPIO_4: RPI_GPIO.4(KL)
RPI_GPIO_5: RPI_GPIO.5(KL)
RPI_GPIO_7: RPI_GPIO.7(KL)
RPI_GPIO_8: RPI_GPIO.8(KL)
RPI_GPIO_9: RPI_GPIO.9(KL)
RPI_GPIO_10: RPI_GPIO.10(KL)
RPI_GPIO_12: RPI_GPIO.12(KL)
RPI_GPIO_14: RPI_GPIO.14(KL)
RPI_GPIO_17: RPI_GPIO.17(KL)
RPI_GPIO_20: RPI_GPIO.20(KL)
RPI_GPIO_25: RPI_GPIO.25(KL)
RPI_GPIO_27: RPI_GPIO.27(KL)
RPI_GPIO_28: RPI_GPIO.28(KL)
RPI_GPIO_29: RPI_GPIO.29(KL)
RPI_GPIO_30: RPI_GPIO.30(KL)
RPI_GPIO_31: RPI_GPIO.31(KL)
RPI_GPIO_32: RPI_GPIO.32(KL)
RPI_GPIO_33: RPI_GPIO.33(KL)
RPI_GPIO_34: RPI_GPIO.34(KL)
RPI_GPIO_35: RPI_GPIO.35(KL)
RPI_GPIO_36: RPI_GPIO.36(KL)
RPI_GPIO_37: RPI_GPIO.37(KL)
RPI_GPIO_38: RPI_GPIO.38(KL)
RPI_GPIO_39: RPI_GPIO.39(KL)
RPI_GPIO_40: RPI_GPIO.40(KL)
SCLK: RPI_GPIO.23(KL)
SOLENOID_1_NEGATIVE: SOL+RELAY.A2_B2(2)
SOLENOID_2_NEGATIVE: SOLENOIDS.A1_B1(1)
SOLENOID_3_NEGATIVE: SOLENOIDS.A2_B2(2)
SOLENOID_4_NEGATIVE: SOLENOIDS2.A1_B1(1)

### Notes on the sheet
- (near LC3/4) External Signal Connectors
- (near PWR_OUT1) External Power Connectors
- (near SOLENOIDS) TODO: Figure out how to properly distinguish these on the hardware board?
- NC
- TC_1
- TC_2
- TC_3
- TC_4
- DO NOT CONNECT
- main
- 9/25/2019 7:26:20 PM
- 8
- Sheet:
- 1
- 2
- 3
- 4
- 5
- 6
- A
- B
- C
- D

### Library data of the parts
LC1/2 LC3/4 PT1/2 PT3/4 THERMOCOUPLES = 1991118: GateName_1: CON; SymbolName_1: STP1; GateName_2: G$2; SymbolName_2: STP2; GateName_3: G$3; SymbolName_3: STP3; GateName_4: G$4; SymbolName_4: STP4; LibraryName: con-phoenix-500-extra; DeviceSetName: 1991118
PWR_OUT1 PWR_OUT2 SOL+RELAY SOLENOIDS SOLENOIDS2 = 1991095: as PWR_IN on sheet main_0; LibraryName: con-phoenix-500-extra; DeviceSetName: 1991095
RPI_GPIO = 2540-5: 3M (TM) Pak 100 4-Wall HeaderSource: 3M; GateName_1: -1; SymbolName_1: PINV; GateName_2: -2; SymbolName_2: PIN; GateName_3: -3; GateName_4: -4; GateName_5: -5; GateName_6: -6; GateName_7: -7; GateName_8: -8; GateName_9: -9; GateName_10: -10; GateName_11: -11; GateName_12: -12; GateName_13: -13; GateName_14: -14; GateName_15: -15; GateName_16: -16; GateName_17: -17; GateName_18: -18; GateName_19: -19; GateName_20: -20; GateName_21: -21; GateName_22: -22; GateName_23: -23; GateName_24: -24; GateName_25: -25; GateName_26: -26; GateName_27: -27; GateName_28: -28; GateName_29: -29; GateName_30: -30; GateName_31: -31; GateName_32: -32; GateName_33: -33; GateName_34: -34; GateName_35: -35; GateName_36: -36; GateName_37: -37; GateName_38: -38; GateName_39: -39; GateName_40: -40; DeviceName: 5; DeviceSetName: 2540-; SymbolName_3: PIN; SymbolName_4: PIN; SymbolName_5: PIN; SymbolName_6: PIN; SymbolName_7: PIN; SymbolName_8: PIN; SymbolName_9: PIN; SymbolName_10: PIN; SymbolName_11: PIN; SymbolName_12: PIN; SymbolName_13: PIN; SymbolName_14: PIN; SymbolName_15: PIN; SymbolName_16: PIN; SymbolName_17: PIN; SymbolName_18: PIN; SymbolName_19: PIN; SymbolName_20: PIN; SymbolName_21: PIN; SymbolName_22: PIN; SymbolName_23: PIN; SymbolName_24: PIN; SymbolName_25: PIN; SymbolName_26: PIN; SymbolName_27: PIN; SymbolName_28: PIN; SymbolName_29: PIN; SymbolName_30: PIN; SymbolName_31: PIN; SymbolName_32: PIN; SymbolName_33: PIN; SymbolName_34: PIN; SymbolName_35: PIN; SymbolName_36: PIN; SymbolName_37: PIN; SymbolName_38: PIN; SymbolName_39: PIN; SymbolName_40: PIN; LibraryName: con-3m; MF: *; MPN: *; OC_FARNELL: 9838414; OC_NEWARK: unknown

## Sheet main_8.SchDoc: main
size 282 x 273 mm; Date: 9/25/2019 7:26:22 PM; SheetNumber: 9; CNAME: RJ Cunningham; GateName_1: G$1; SymbolName_1: A4L-LOC; LibraryName: frames; DeviceSetName: A4L-LOC
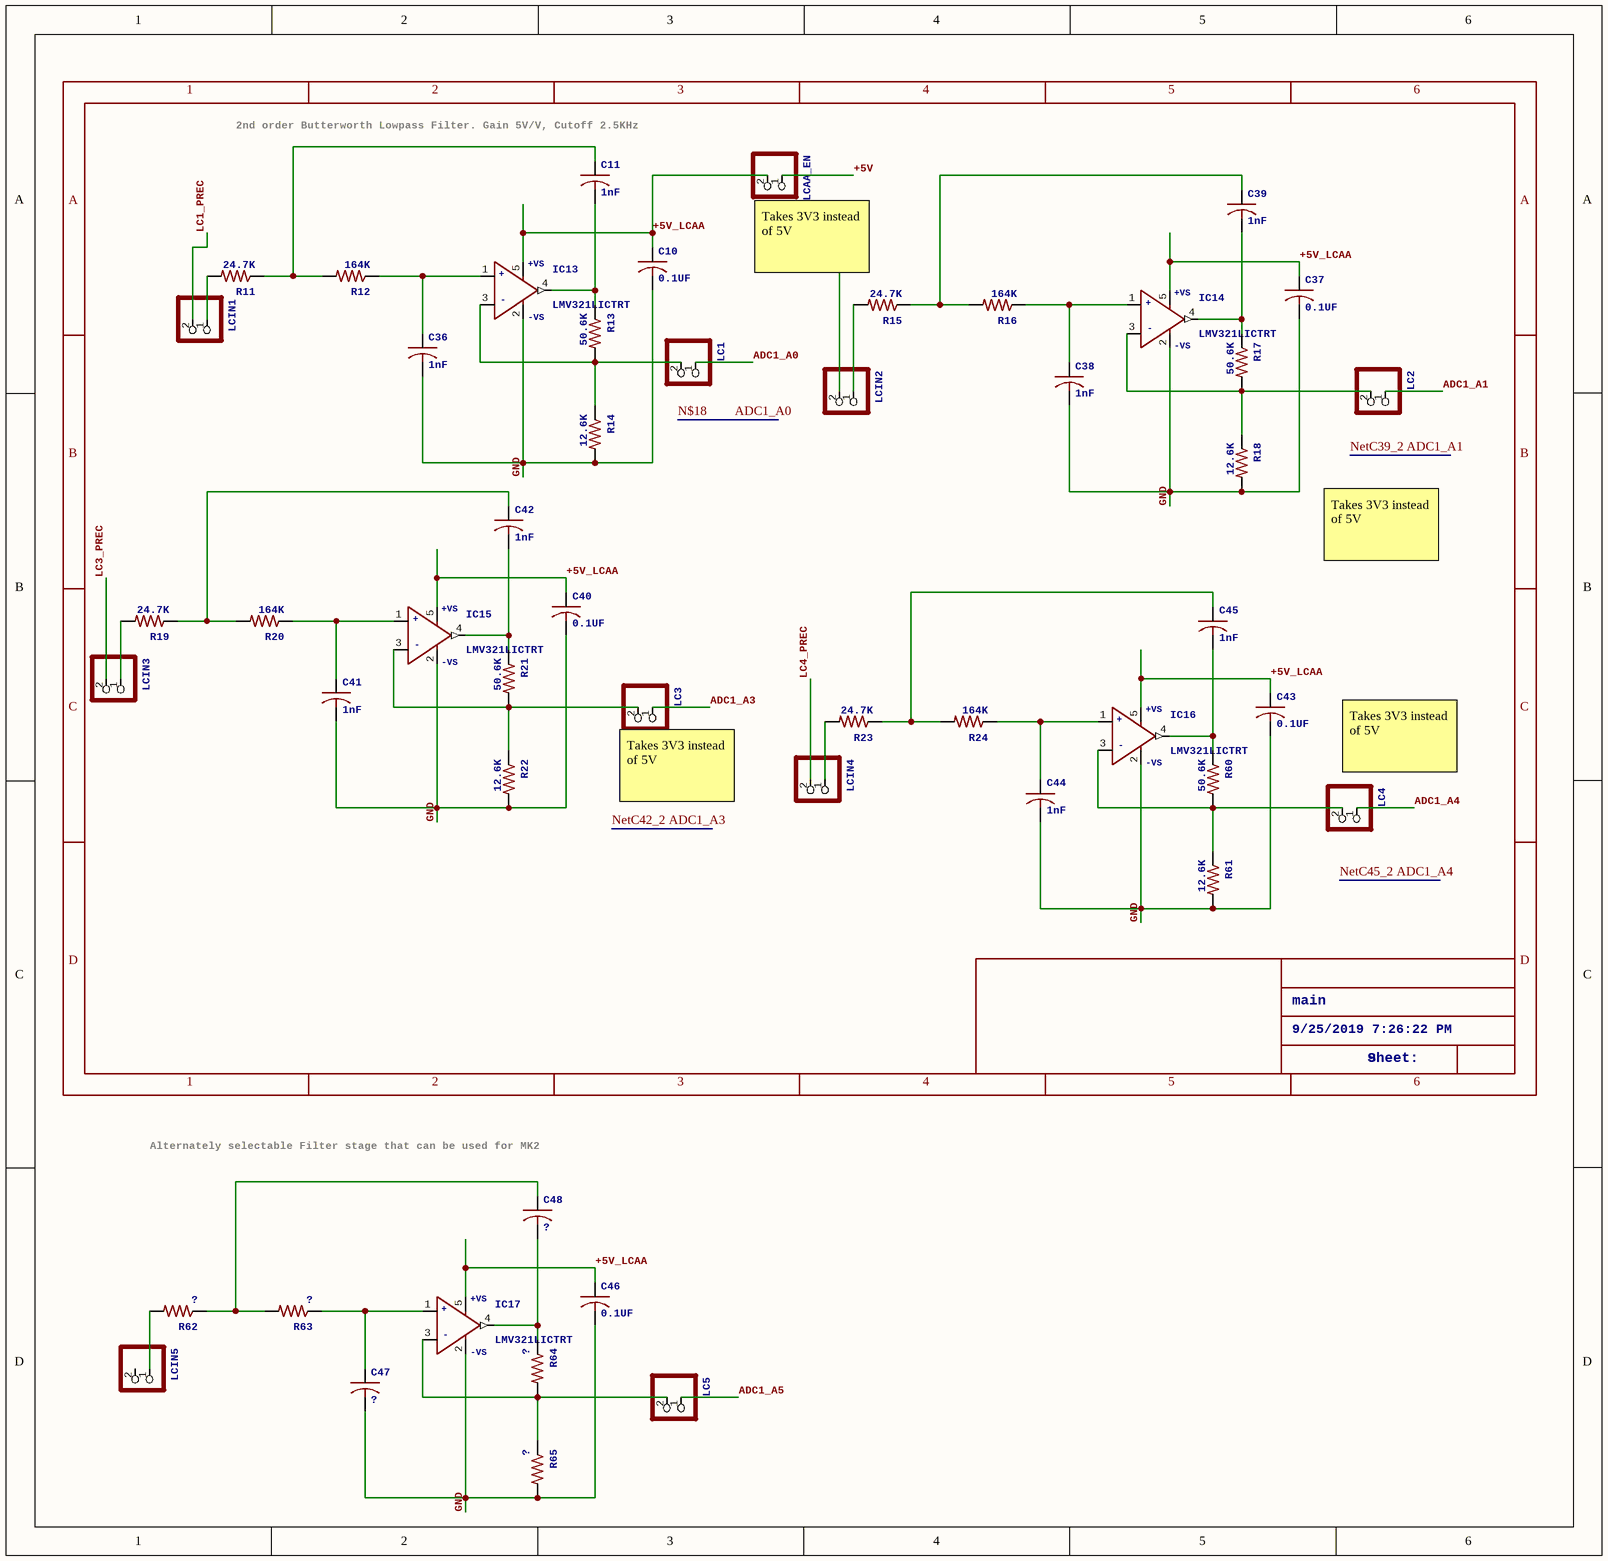
[diagram p8: main_8.SchDoc]

### Parts
C10  0.1UF  [C0805]
C11  1nF  [C0805]
C36  1nF  [C0805]
C37  0.1UF  [C0805]
C38  1nF  [C0805]
C39  1nF  [C0805]
C40  0.1UF  [C0805]
C41  1nF  [C0805]
C42  1nF  [C0805]
C43  0.1UF  [C0805]
C44  1nF  [C0805]
C45  1nF  [C0805]
C46  0.1UF  [C0805]
C47  ?  [C0805]
C48  ?  [C0805]
IC13  LMV321LICTRT  [SOT23-5]
IC14  LMV321LICTRT  [SOT23-5]
IC15  LMV321LICTRT  [SOT23-5]
IC16  LMV321LICTRT  [SOT23-5]
IC17  LMV321LICTRT  [SOT23-5]
LC1  PINHD-1X2  [1X02]  (value not drawn)
LC2  PINHD-1X2  [1X02]  (value not drawn)
LC3  PINHD-1X2  [1X02]  (value not drawn)
LC4  PINHD-1X2  [1X02]  (value not drawn)
LC5  PINHD-1X2  [1X02]  (value not drawn)
LCAA_EN  PINHD-1X2  [1X02]  (value not drawn)
LCIN1  PINHD-1X2  [1X02]  (value not drawn)
LCIN2  PINHD-1X2  [1X02]  (value not drawn)
LCIN3  PINHD-1X2  [1X02]  (value not drawn)
LCIN4  PINHD-1X2  [1X02]  (value not drawn)
LCIN5  PINHD-1X2  [1X02]  (value not drawn)
R11  24.7K  [R0805]
R12  164K  [R0805]
R13  50.6K  [R0805]
R14  12.6K  [R0805]
R15  24.7K  [R0805]
R16  164K  [R0805]
R17  50.6K  [R0805]
R18  12.6K  [R0805]
R19  24.7K  [R0805]
R20  164K  [R0805]
R21  50.6K  [R0805]
R22  12.6K  [R0805]
R23  24.7K  [R0805]
R24  164K  [R0805]
R60  50.6K  [R0805]
R61  12.6K  [R0805]
R62  ?  [R0805]
R63  ?  [R0805]
R64  ?  [R0805]
R65  ?  [R0805]

### Nets
+5V: LCAA_EN.1
+5V_LCAA: C10.1 C37.1 C40.1 C43.1 C46.1 IC13.5(+VS) IC14.5(+VS) IC15.5(+VS) IC16.5(+VS) IC17.5(+VS) LCAA_EN.2
ADC1_A0: LC1.1  [also labelled N$18]
ADC1_A1: LC2.1  [also labelled NetC39_2]
ADC1_A3: LC3.1  [also labelled NetC42_2]
ADC1_A4: LC4.1  [also labelled NetC45_2]
ADC1_A5: LC5.1
GND: C10.2 C36.2 C37.2 C38.2 C40.2 C41.2 C43.2 C44.2 C46.2 C47.2 IC13.2(-VS) IC14.2(-VS) IC15.2(-VS) IC16.2(-VS) IC17.2(-VS) R14.2 R18.2 R22.2 R61.2 R65.2
LC1_PREC: LCIN1.2
LC2_PREC: LCIN2.2
LC3_PREC: LCIN3.2
LC4_PREC: LCIN4.2
NetC11_1: C11.1 R11.1 R12.2
NetC11_2: C11.2 IC13.4(OUT) R13.1
NetC36_1: C36.1 IC13.1(IN+) R12.1
NetC38_1: C38.1 IC14.1(IN+) R16.1
NetC39_1: C39.1 R15.1 R16.2
NetC39_2: C39.2 IC14.4(OUT) R17.1
NetC41_1: C41.1 IC15.1(IN+) R20.1
NetC42_1: C42.1 R19.1 R20.2
NetC42_2: C42.2 IC15.4(OUT) R21.1
NetC44_1: C44.1 IC16.1(IN+) R24.1
NetC45_1: C45.1 R23.1 R24.2
NetC45_2: C45.2 IC16.4(OUT) R60.1
NetC47_1: C47.1 IC17.1(IN+) R63.1
NetC48_1: C48.1 R62.1 R63.2
NetC48_2: C48.2 IC17.4(OUT) R64.1
NetIC13_3: IC13.3(IN-) LC1.2 R13.2 R14.1
NetIC14_3: IC14.3(IN-) LC2.2 R17.2 R18.1
NetIC15_3: IC15.3(IN-) LC3.2 R21.2 R22.1
NetIC16_3: IC16.3(IN-) LC4.2 R60.2 R61.1
NetIC17_3: IC17.3(IN-) LC5.2 R64.2 R65.1
NetLCIN1_1: LCIN1.1 R11.2
NetLCIN2_1: LCIN2.1 R15.2
NetLCIN3_1: LCIN3.1 R19.2
NetLCIN4_1: LCIN4.1 R23.2
NetLCIN5_1: LCIN5.1 R62.2

Not connected (* = marked no-connect by the designer): LCIN5 2

### Notes on the sheet
- 2nd order Butterworth Lowpass Filter. Gain 5V/V, Cutoff 2.5KHz
- (near LCAA_EN) Takes 3V3 instead of 5V
- Takes 3V3 instead of 5V
- (near LC3) Takes 3V3 instead of 5V
- main
- 9/25/2019 7:26:22 PM
- 9
- Sheet:
- Alternately selectable Filter stage that can be used for MK2
- 1
- 2
- 3
- 4
- 5
- 6
- A
- B
- C
- D

### Library data of the parts
C10 C11 C36-C48 = C-USC0805: as C12 on sheet main_1; DeviceName: C0805; LibraryName: rcl; DeviceSetName: C-US; SPICEPREFIX: C
IC13-IC17 = LMV321LICTRT: as IC1 on sheet main_2; LibraryName: st-microelectronics-extra; DeviceSetName: LMV321LICT; OC_FARNELL: 1464845; OC_NEWARK: 59K6316; +: +; -: -; +VS: +VS; -VS: -VS
LC1-LC5 LCAA_EN LCIN1-LCIN5 = PINHD-1X2: as JP4 on sheet main_1; LibraryName: pinhead; DeviceSetName: PINHD-1X2
R11-R24 R60-R65 = R-US_R0805: as R26 on sheet main_0; DeviceName: R0805; LibraryName: rcl

## Sheet main_9.SchDoc
size 212 x 108 mm; CNAME: RJ Cunningham
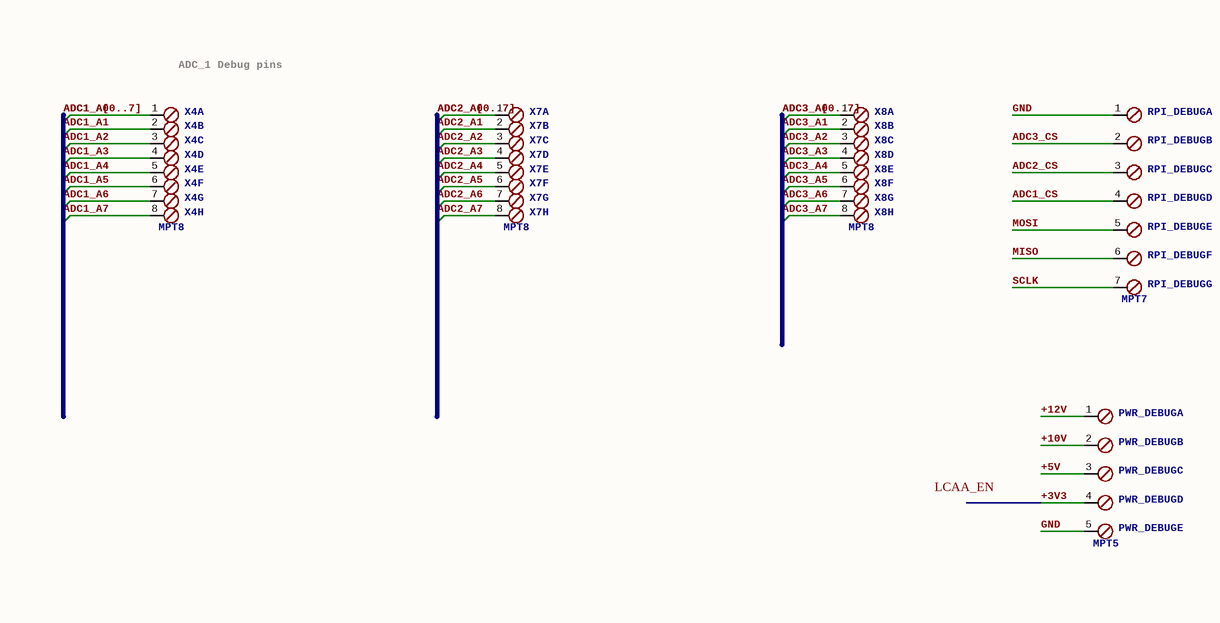
[diagram p9: main_9.SchDoc]

### Parts
PWR_DEBUG  MPT5  [5POL254]  (value not drawn)  (parts A,B,C,D,E of 5)
RPI_DEBUG  MPT7  [7POL254]  (value not drawn)  (parts A,B,C,D,E,F,G of 7)
X4  MPT8  [8POL254]  (value not drawn)  (parts A,B,C,D,E,F,G,H of 8)
X7  MPT8  [8POL254]  (value not drawn)  (parts A,B,C,D,E,F,G,H of 8)
X8  MPT8  [8POL254]  (value not drawn)  (parts A,B,C,D,E,F,G,H of 8)

### Nets
+3V3: PWR_DEBUG.4
+5V: PWR_DEBUG.3
+10V: PWR_DEBUG.2
+12V: PWR_DEBUG.1
ADC1_CS: RPI_DEBUG.4
ADC2_CS: RPI_DEBUG.3
ADC3_CS: RPI_DEBUG.2
GND: PWR_DEBUG.5 RPI_DEBUG.1
MISO: RPI_DEBUG.6
MOSI: RPI_DEBUG.5
SCLK: RPI_DEBUG.7

Not connected (* = marked no-connect by the designer): X4 1 2(1) 3(1) 4(1) 5(1) 6(1) 7(1) 8(1); X7 1 2(1) 3(1) 4(1) 5(1) 6(1) 7(1) 8(1); X8 1 2(1) 3(1) 4(1) 5(1) 6(1) 7(1) 8(1)

### Buses and harness runs
bus ADC1_A0 = ADC1_A1 = ADC1_A2 = ADC1_A3 = ADC1_A4 = ADC1_A5 = ADC1_A6 = ADC1_A7 = ADC1_A[0..7]
bus ADC2_A0 = ADC2_A1 = ADC2_A2 = ADC2_A3 = ADC2_A4 = ADC2_A5 = ADC2_A6 = ADC2_A7 = ADC2_A[0..7]
bus ADC3_A0 = ADC3_A1 = ADC3_A2 = ADC3_A3 = ADC3_A4 = ADC3_A5 = ADC3_A6 = ADC3_A7 = ADC3_A[0..7]

### Notes on the sheet
- (near X4) ADC_1 Debug pins
- Labels drawn without touching a wire or pin: LCAA_EN

### Library data of the parts
PWR_DEBUG = MPT5: PHOENIX CONNECTOR; GateName_1: -1; SymbolName_1: SKB; GateName_2: -2; GateName_3: -3; GateName_4: -4; GateName_5: -5; SymbolName_5: SKBV; SymbolName_2: SKB; SymbolName_3: SKB; SymbolName_4: SKB; LibraryName: con-phoenix-254; DeviceSetName: MPT5; MF: *; MPN: *; OC_FARNELL: unknown; OC_NEWARK: unknown
RPI_DEBUG = MPT7: PHOENIX CONNECTOR; GateName_1: -1; SymbolName_1: SKB; GateName_2: -2; GateName_3: -3; GateName_4: -4; GateName_5: -5; GateName_6: -6; GateName_7: -7; SymbolName_7: SKBV; SymbolName_2: SKB; SymbolName_3: SKB; SymbolName_4: SKB; SymbolName_5: SKB; SymbolName_6: SKB; LibraryName: con-phoenix-254; DeviceSetName: MPT7; MF: *; MPN: *; OC_FARNELL: unknown; OC_NEWARK: unknown
X4 X7 X8 = MPT8: PHOENIX CONNECTOR; GateName_1: -1; SymbolName_1: SKB; GateName_2: -2; GateName_3: -3; GateName_4: -4; GateName_5: -5; GateName_6: -6; GateName_7: -7; GateName_8: -8; SymbolName_8: SKBV; SymbolName_2: SKB; SymbolName_3: SKB; SymbolName_4: SKB; SymbolName_5: SKB; SymbolName_6: SKB; SymbolName_7: SKB; LibraryName: con-phoenix-254; DeviceSetName: MPT8; MF: *; MPN: *; OC_FARNELL: unknown; OC_NEWARK: unknown

## Nets that join several sheets
+3V3: main_0 (3.3V_REG.2 +3.3V_LED.A C4.+ R?#1.1), main_1 (JP4.1), main_3 (JP1.1), main_2 (JP2.1), main_7 (PWR_OUT2.A1 B1), main_9 (PWR_DEBUG.4)
+5V: main_0 (6 pins), main_6 (8 pins), main_7 (PWR_OUT2.A2 B2), main_8 (LCAA_EN.1), main_9 (PWR_DEBUG.3)
+10V: main_0 (5 pins), main_7 (5 pins), main_9 (PWR_DEBUG.2)
+12V: main_0 (10V_REG.1 +12V_LED.A C17.+ D5.C), main_4 (D2.C D3.C D4.C D6.C), main_5 (D1.C), main_7 (PWR_OUT1.A2 B2), main_9 (PWR_DEBUG.1)
ADC1_CS: main_3 (ADC1.10 R25.1), main_7 (RPI_GPIO.22), main_9 (RPI_DEBUG.4)
ADC2_CS: main_3 (ADC2.10 R29.1), main_7 (RPI_GPIO.24), main_9 (RPI_DEBUG.3)
ADC3_CS: main_3 (ADC3.10 R30.1), main_7 (RPI_GPIO.26), main_9 (RPI_DEBUG.2)
CTRL_SOLENOID_1: main_4 (R3.1), main_7 (RPI_GPIO.11)
CTRL_SOLENOID_2: main_4 (R5.1), main_7 (RPI_GPIO.13)
CTRL_SOLENOID_3: main_4 (R7.1), main_7 (RPI_GPIO.15)
CTRL_SOLENOID_4: main_4 (R9.1), main_7 (RPI_GPIO.18)
GND: main_0 (14 pins), main_1 (13 pins), main_3 (9 pins), main_2 (16 pins), main_4 (8 pins), main_5 (R2.2 U$2.2), main_6 (16 pins), main_7 (RPI_GPIO.6), main_8 (20 pins), main_9 (PWR_DEBUG.5 RPI_DEBUG.1)
IGNITION_RELAY: main_5 (R1.1), main_7 (RPI_GPIO.16)
LC1_PREC: main_1 (IC5.6 RF1.1), main_8 (LCIN1.2)
LC2_PREC: main_1 (IC10.6 RF2.1), main_8 (LCIN2.2)
LC3_PREC: main_1 (IC11.6 RF3.1), main_8 (LCIN3.2)
LC4_PREC: main_1 (IC12.6 RF4.1), main_8 (LCIN4.2)
LC_1_OUT+: main_1 (IC5.3), main_7 (LC1/2.A3 B3)
LC_1_OUT-: main_1 (IC5.2), main_7 (LC1/2.A4 B4)
LC_2_OUT+: main_1 (IC10.3), main_7 (LC1/2.A1 B1)
LC_2_OUT-: main_1 (IC10.2), main_7 (LC1/2.A2 B2)
LC_3_OUT+: main_1 (IC11.3), main_7 (LC3/4.A3 B3)
LC_3_OUT-: main_1 (IC11.2), main_7 (LC3/4.A4 B4)
LC_4_OUT+: main_1 (IC12.3), main_7 (LC3/4.A1 B1)
LC_4_OUT-: main_1 (IC12.2), main_7 (LC3/4.A2 B2)
MISO: main_3 (ADC1.12 ADC2.12 ADC3.12), main_7 (RPI_GPIO.21), main_9 (RPI_DEBUG.6)
MOSI: main_3 (ADC1.11 ADC2.11 ADC3.11), main_7 (RPI_GPIO.19), main_9 (RPI_DEBUG.5)
PT1_PREC: main_2 (IC1.4 R37.1), main_6 (R41.2)
PT1_VS-: main_2 (R31.2 R36.2), main_7 (PT1/2.A2 B2)
PT2_PREC: main_2 (IC2.4 R43.1), main_6 (R46.2)
PT2_VS-: main_2 (R32.2 R42.2), main_7 (PT1/2.A4 B4)
PT3_PREC: main_2 (IC3.4 R52.1), main_6 (R48.2)
PT3_VS-: main_2 (R33.2 R34.2), main_7 (PT3/4.A2 B2)
PT4_PREC: main_2 (IC4.4 R57.1), main_6 (R50.2)
PT4_VS-: main_2 (R55.2 R56.2), main_7 (PT3/4.A4 B4)
R10_atch: main_4 (R9.2 R10.1 U$5.G), main_5 (D1.A R?#2.2 U$2.3), main_7 (SOL+RELAY.A1 B1)
SCLK: main_3 (ADC1.13 ADC2.13 ADC3.13), main_7 (RPI_GPIO.23), main_9 (RPI_DEBUG.7)
SOLENOID_1_NEGATIVE: main_4 (D2.A U$3.3), main_7 (SOL+RELAY.A2 B2)
SOLENOID_2_NEGATIVE: main_4 (D3.A U$8.3), main_7 (SOLENOIDS.A1 B1)
SOLENOID_3_NEGATIVE: main_4 (D4.A U$9.3), main_7 (SOLENOIDS.A2 B2)
SOLENOID_4_NEGATIVE: main_4 (D6.A U$5.D), main_7 (SOLENOIDS2.A1 B1)